# EasyEDA Pro project EasyEDA_Project_open PoE+ Pi HAT_2024-05-05.epro

# Schematic open PoE+ Pi HAT
Create Date: 2024-05-04; Page Name: SCH; Project Name: open PoE+ Pi HAT; Schematic Name: open PoE+ Pi HAT; Update Date: 2024-05-05; Company: Rex Tang; Page Size: A4; Version: V1.0
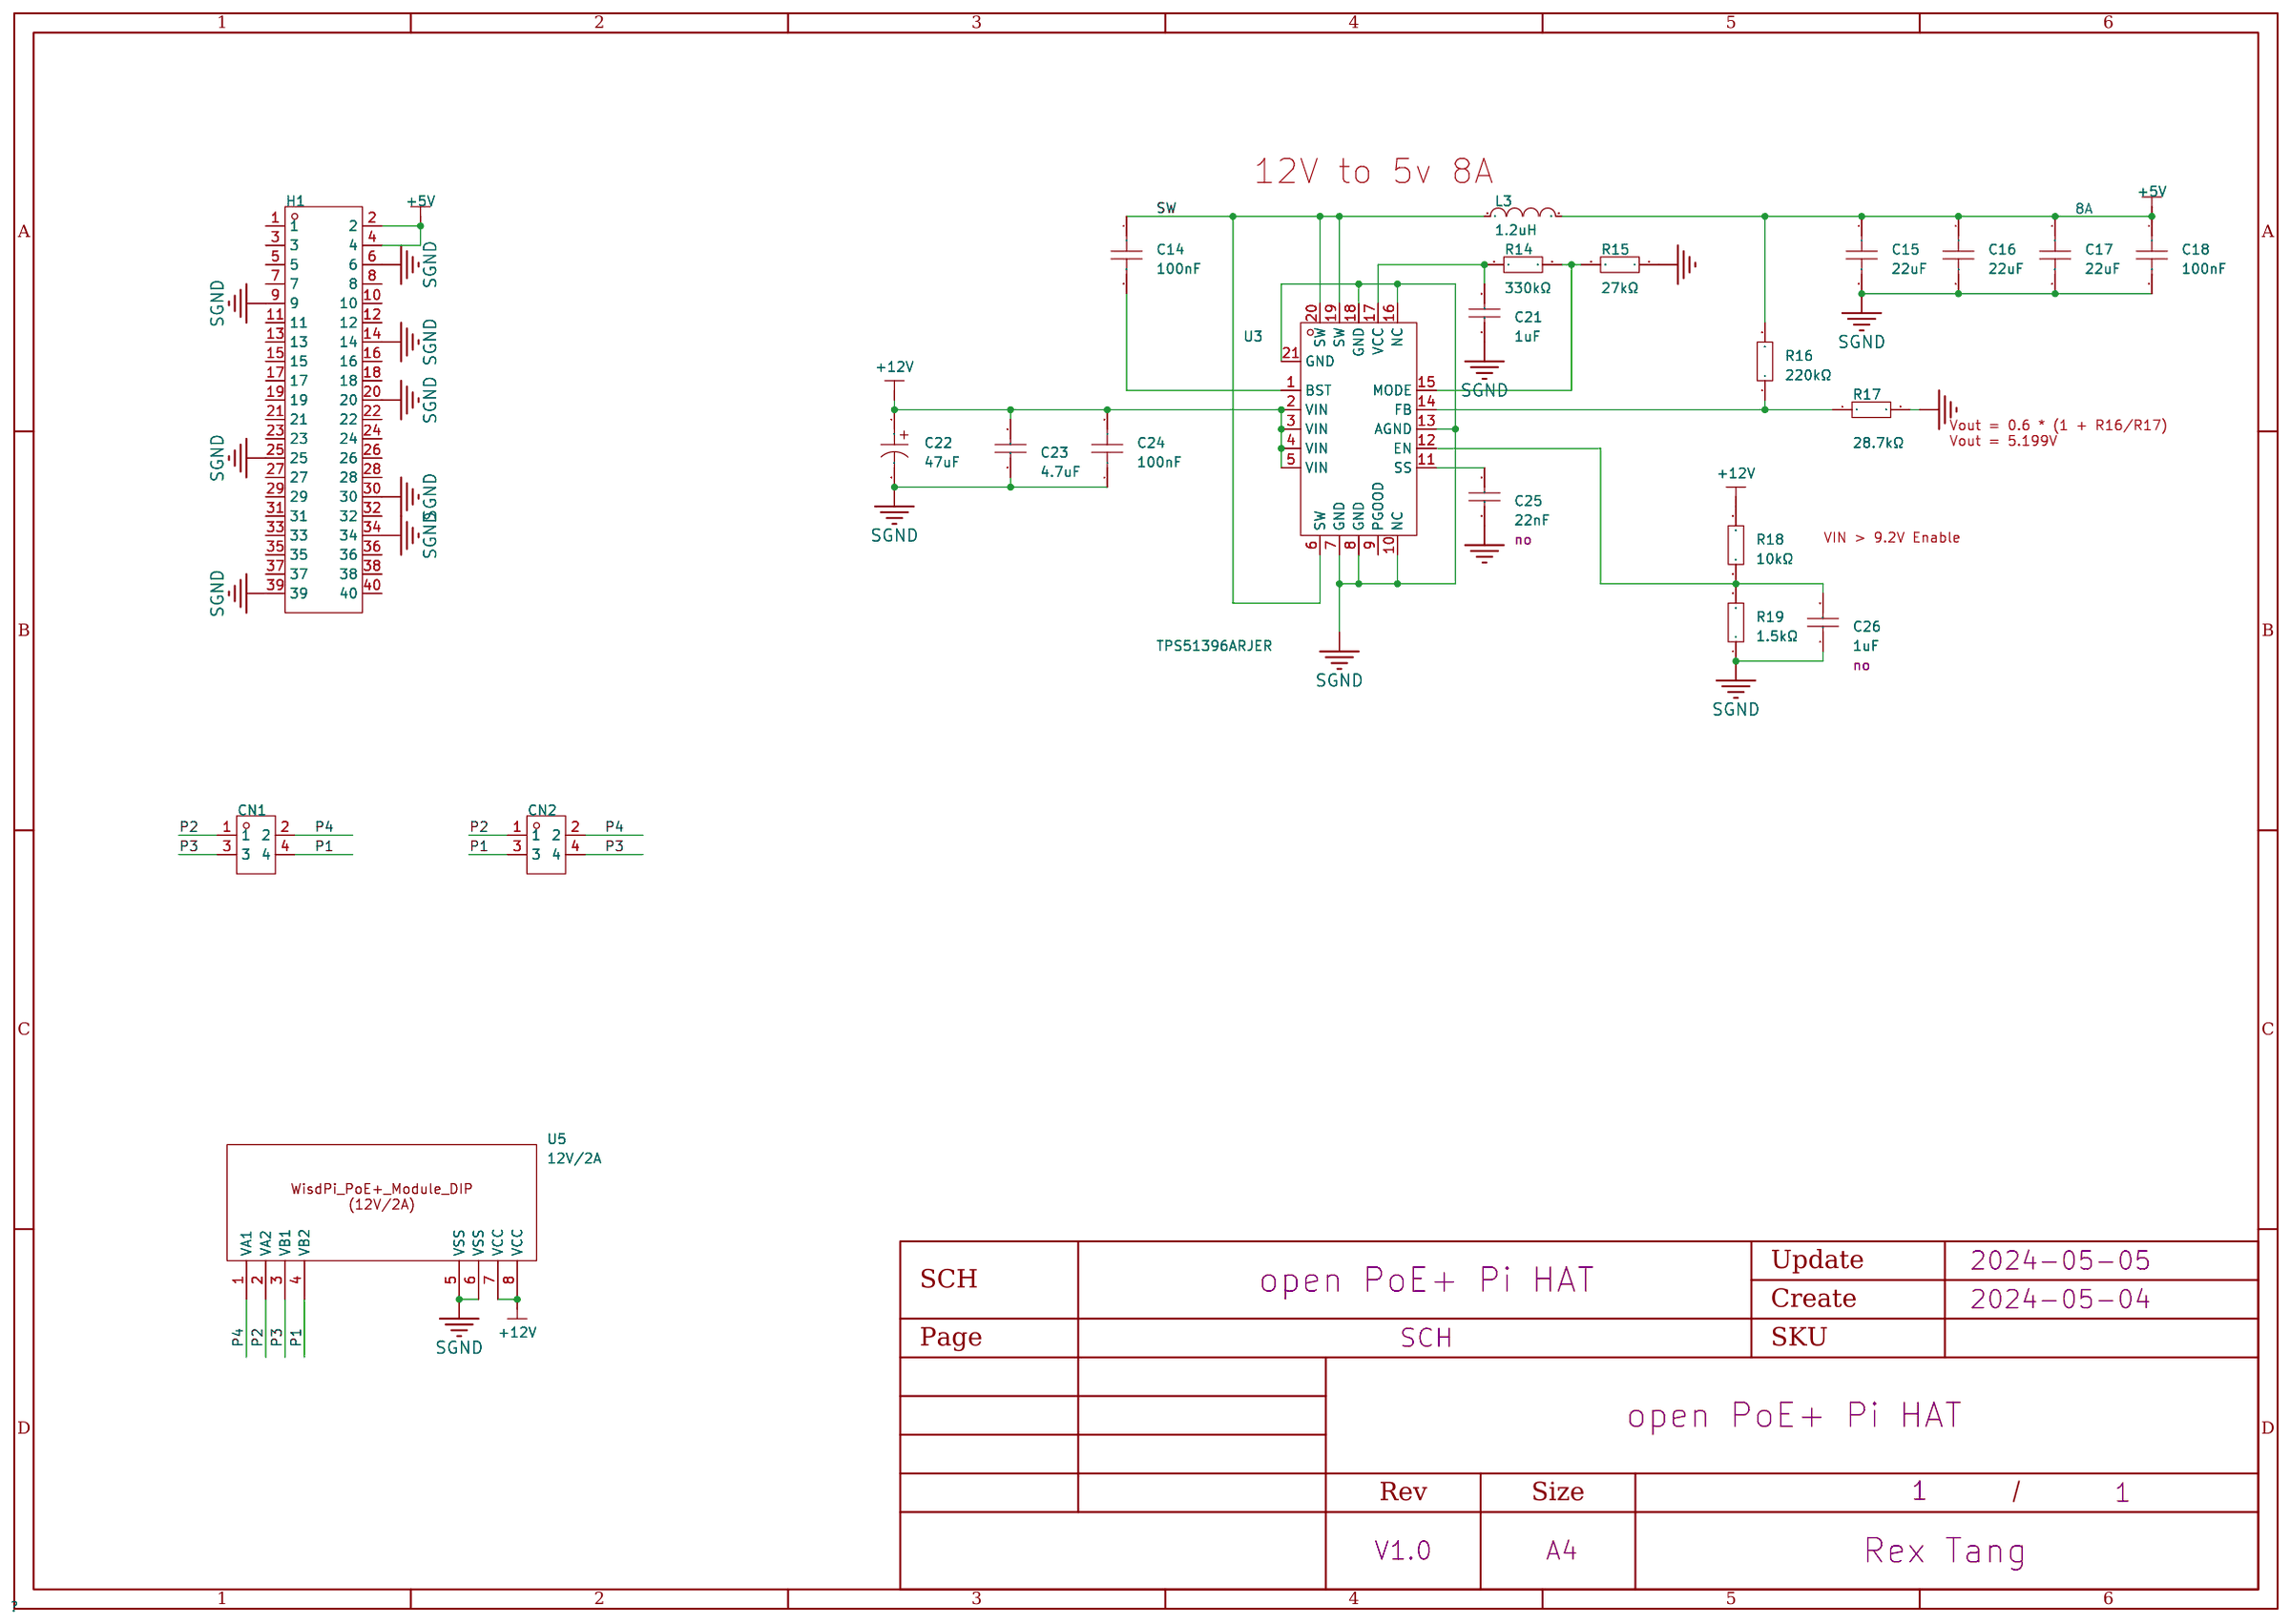
[diagram p0: schematic sheet]

## Parts
C14  100nF  [C0603]
C15  22uF  [C0603]
C16  22uF  [C0603]
C17  22uF  [C0603]
C18  100nF  [C0603]
C21  1uF  [C0603]
C22  47uF  [CAP-SMD_BD6.3-L6.6-W6.6-LS7.2-FD]
C23  4.7uF  [C1206]
C24  100nF  [C0603]
C25  22nF  [C0603]  (no BOM)
C26  1uF  [C0603]  (no BOM)
CN1  PM254-2-02-S-8.5  [HDR-SMD_4P-P2.54-V-F-R2-C2-S7.2]
CN2  PM254-2-02-S-8.5  [HDR-SMD_4P-P2.54-V-F-R2-C2-S7.2]
H1  FH-00339  [HDR-SMD_40P-P2.54-V-F-R2-C20-S6.6-EH]
L3  1.2uH  [IND-SMD_L5.4-W5.2]
R14  330kΩ  [R0603]
R15  27kΩ  [R0603]
R16  220kΩ  [R0603]
R17  28.7kΩ  [R0603]
R18  10kΩ  [R0603]
R19  1.5kΩ  [R0603]
U3  TPS51396ARJER  [QFN-20_L3.0-W3.0-P0.45-BL-EP1.0]
U5  12V/2A  [WisdPi_PoE+_Module_DIP]

## Library data of the parts
C14 C18 C24 = CL10B104KB8NNNC: 容值:100nF;精度:±10%;额定电压:50V;材质(温度系数):X7R;; LCSC Part Name: 100nF ±10% 50V; Supplier Part: C1591; Manufacturer: SAMSUNG(三星); Supplier Footprint: 0603; JLCPCB Part Class: Extended Part; Datasheet: https://atta.szlcsc.com/upload/public/pdf/source/20160103/1457707680512.pdf; Supplier: LCSC; Tolerance: ±10%; Voltage Rated: 50V; Temperature Coefficient: X7R
C15-C17 = CL10A226MP8NUNE: 容值:22uF;精度:±20%;额定电压:10V;材质(温度系数):X5R;; LCSC Part Name: 22uF ±20% 10V; Supplier Part: C86295; Manufacturer: SAMSUNG(三星); Supplier Footprint: 0603; JLCPCB Part Class: Extended Part; Datasheet: https://atta.szlcsc.com/upload/public/pdf/source/20170325/1490427882169.pdf; Supplier: LCSC; Tolerance: ±20%; Voltage Rated: 10V; Temperature Coefficient: X5R
C21 C26 = CL10A105KB8NNNC: 容值:1uF;精度:±10%;额定电压:50V;材质(温度系数):X5R;; LCSC Part Name: 1uF ±10% 50V; Supplier Part: C15849; Manufacturer: SAMSUNG(三星); Supplier Footprint: 0603; JLCPCB Part Class: Basic Part; Datasheet: https://atta.szlcsc.com/upload/public/pdf/source/20160103/1457707679084.pdf; Supplier: LCSC; Tolerance: ±10%; Voltage Rated: 50V; Temperature Coefficient: X5R
C22 = RVT47UF35V67RV0039: 容值:47uF;精度:±20%;额定电压:35V;纹波电流:16.4mA@120Hz;等效串联电阻:-;; LCSC Part Name: 47uF ±20% 35V; Supplier Part: C2836440; Manufacturer: KNSCHA(科尼盛); Supplier Footprint: SMD,D6.3xL5.4mm; JLCPCB Part Class: Extended Part; Datasheet: https://atta.szlcsc.com/upload/public/pdf/source/20210528/C2836440_FB61BB3A7A46B9CC2A608A35871DBF0C.pdf; Supplier: LCSC; Tolerance: ±20%; Rated Voltage: 35V; Ripple Current: 16.4mA@120Hz; φD: 6.3mm; L: 5.4mm; Lifetime @ Temp: 2000hrs@105℃; Operating Temperature: -55℃~+105℃
C23 = CL31B475KBHNNNE: 容值:4.7uF;精度:±10%;额定电压:50V;材质(温度系数):X7R;; LCSC Part Name: 4.7uF ±10% 50V; Supplier Part: C51205; Manufacturer: SAMSUNG(三星); Supplier Footprint: 1206; JLCPCB Part Class: Extended Part; Datasheet: https://atta.szlcsc.com/upload/public/pdf/source/20160103/1457707732693.pdf; Supplier: LCSC; Tolerance: ±10%; Voltage Rated: 50V; Temperature Coefficient: X7R
C25 = CL10B223KB8NNNC: 容值:22nF;精度:±10%;额定电压:50V;材质(温度系数):X7R;; LCSC Part Name: 22nF ±10% 50V; Supplier Part: C21122; Manufacturer: SAMSUNG(三星); Supplier Footprint: 0603; JLCPCB Part Class: Basic Part; Datasheet: https://atta.szlcsc.com/upload/public/pdf/source/20160103/1457707705232.pdf; Supplier: LCSC; Tolerance: ±10%; Voltage Rated: 50V; Temperature Coefficient: X7R
CN1 CN2 = PM254-2-02-S-8.5: 插孔结构:2x2P;间距:2.54mm;圆孔/方孔:方孔;安装类型:立贴;排数:双排;总孔位数:4P;额定电流:1A;插孔方向:顶部;塑高:8.5mm;; LCSC Part Name: 2x2P 间距:2.54mm 立贴; Supplier Part: C3975147; Manufacturer: HCTL(华灿天禄); Supplier Footprint: SMD,P=2.54mm; JLCPCB Part Class: 扩展库; Datasheet: https://atta.szlcsc.com/upload/public/pdf/source/20230609/7C6F8D8E301C6BBC8F19D55951C36597.pdf; Supplier: LCSC; Holes Structure: 2x2P; Pitch: 2.54mm; Circular Hole / Square Hole: 方孔; Mounting Type: 立贴; Number of Rows: 双排; Number of Holes: 4P; Current Rating (Max): 1A; Holes Direction: 顶部; Insulation Height: 8.5mm
H1 = FH-00339: 排数:双排;总孔位数:40P;间距:2.54mm;插孔结构:2x20P;行距:2.54mm;安装类型:立贴;圆孔/方孔:方孔;额定电流:3A;额定电压:-;插孔方向:顶部;塑高:3.9mm;工作温度范围:-40℃~+105℃;; LCSC Part Name: 间距:2.54mm 2x20P 立贴; Supplier Part: C2685112; Manufacturer: Liansheng(连盛); Supplier Footprint: SMD,P=2.54mm; JLCPCB Part Class: 扩展库; Datasheet: https://atta.szlcsc.com/upload/public/pdf/source/20210125/C2685112_060580B9A9680CD6D14F0E96D1B5C8CF.pdf; Supplier: LCSC; Number of Rows: 双排; Number of Holes: 40P; Pitch: 2.54mm; Holes Structure: 2x20P; Row Spacing: 2.54mm; Mounting Type: 立贴; Circular Hole / Square Hole: 方孔; Current Rating (Max): 3A; Holes Direction: 顶部; Insulation Height: 3.9mm; Operating Temperature Range: -40℃~+105℃
L3 = MWSA0503S-1R2MT: 精度:±20%;电感值:1.2uH;额定电流:-;直流电阻(DCR):-;; LCSC Part Name: 1.2uH ±20%; Supplier Part: C408356; Manufacturer: Sunlord(顺络); Supplier Footprint: SMD; JLCPCB Part Class: Extended Part; Datasheet: https://atta.szlcsc.com/upload/public/pdf/source/20190729/C408356_5A3E2289536D2ED1F8380EE8E4397875.pdf; Supplier: LCSC; Width: 5.4mm; Tolerance: ±20%; Height: 3mm; Length: 5.2mm
R14 = 0603WAF3303T5E: 电阻类型:厚膜电阻;阻值:330kΩ;精度:±1%;功率:100mW;; LCSC Part Name: 330kΩ ±1% 100mW; Supplier Part: C23137; Manufacturer: UNI-ROYAL(厚声); Supplier Footprint: 0603; JLCPCB Part Class: Basic Part; Datasheet: https://atta.szlcsc.com/upload/public/pdf/source/20200306/C422600_1E6D84923E4A46A82E41ADD87F860B5C.pdf; Supplier: LCSC; Type: 厚膜电阻; Tolerance: ±1%; Power(Watts): 100mW; Temperature Coefficient: ±100ppm/℃; Overload Voltage (Max): 75V; Operating Temperature Range: -55℃~+155℃
R15 = 0603WAF2702T5E: 电阻类型:厚膜电阻;阻值:27kΩ;精度:±1%;功率:100mW;; LCSC Part Name: 27kΩ ±1% 100mW; Supplier Part: C22967; Manufacturer: UNI-ROYAL(厚声); Supplier Footprint: 0603; JLCPCB Part Class: Basic Part; Datasheet: https://atta.szlcsc.com/upload/public/pdf/source/20200306/C422600_1E6D84923E4A46A82E41ADD87F860B5C.pdf; Supplier: LCSC; Type: 厚膜电阻; Tolerance: ±1%; Power(Watts): 100mW; Temperature Coefficient: ±100ppm/℃; Overload Voltage (Max): 75V; Operating Temperature Range: -55℃~+155℃
R16 = 0603WAF2203T5E: 电阻类型:厚膜电阻;阻值:220kΩ;精度:±1%;功率:100mW;; LCSC Part Name: 220kΩ ±1% 100mW; Supplier Part: C22961; Manufacturer: UNI-ROYAL(厚声); Supplier Footprint: 0603; JLCPCB Part Class: Basic Part; Datasheet: https://atta.szlcsc.com/upload/public/pdf/source/20200306/C422600_1E6D84923E4A46A82E41ADD87F860B5C.pdf; Supplier: LCSC; Type: 厚膜电阻; Tolerance: ±1%; Power(Watts): 100mW; Temperature Coefficient: ±100ppm/℃; Overload Voltage (Max): 75V; Operating Temperature Range: -55℃~+155℃
R17 = 0603WAF2872T5E: 阻值:28.7kΩ;精度:±1%;功率:100mW;温度系数:±100ppm/℃;电阻类型:厚膜电阻;; LCSC Part Name: 28.7kΩ ±1% 100mW 厚膜电阻; Supplier Part: C22928; Manufacturer: UNI-ROYAL(厚声); Supplier Footprint: 0603; JLCPCB Part Class: Extended Part; Datasheet: https://atta.szlcsc.com/upload/public/pdf/source/20200306/C422600_1E6D84923E4A46A82E41ADD87F860B5C.pdf; Supplier: LCSC; Tolerance: ±1%; Power(Watts): 100mW; Overload Voltage (Max): 75V; Temperature Coefficient: ±100ppm/℃; Type: 厚膜电阻; Operating Temperature Range: -55℃~+155℃
R18 = 0603WAF1002T5E: 电阻类型:厚膜电阻;阻值:10kΩ;精度:±1%;功率:100mW;; LCSC Part Name: 厚膜电阻 10kΩ ±1% 100mW; Supplier Part: C25804; Manufacturer: UNI-ROYAL(厚声); Supplier Footprint: 0603; JLCPCB Part Class: 基础库; Datasheet: https://atta.szlcsc.com/upload/public/pdf/source/20200306/C422600_1E6D84923E4A46A82E41ADD87F860B5C.pdf; Supplier: LCSC; Type: 厚膜电阻; Tolerance: ±1%; Power(Watts): 100mW; Temperature Coefficient: ±100ppm/℃; Overload Voltage (Max): 75V; Operating Temperature Range: -55℃~+155℃
R19 = 0603WAF1501T5E: 电阻类型:厚膜电阻;阻值:1.5kΩ;精度:±1%;功率:100mW;最大工作电压:75V;温度系数:±100ppm/℃;; LCSC Part Name: 1.5kΩ ±1% 100mW 厚膜电阻; Supplier Part: C22843; Manufacturer: UNI-ROYAL(厚声); Supplier Footprint: 0603; JLCPCB Part Class: 基础库; Datasheet: https://atta.szlcsc.com/upload/public/pdf/source/20200306/C422600_1E6D84923E4A46A82E41ADD87F860B5C.pdf; Supplier: LCSC; Type: 厚膜电阻; Tolerance: ±1%; Power(Watts): 100mW; Overload Voltage (Max): 75V; Temperature Coefficient: ±100ppm/℃; Operating Temperature Range: -55℃~+155℃
U3 = TPS51396ARJER: Supplier Part: C3032872; Manufacturer: TI(德州仪器); Supplier Footprint: QFN-20-EP(3x3); JLCPCB Part Class: Extended Part; Datasheet: https://atta.szlcsc.com/upload/public/pdf/source/20230222/57DF248B7417CFF68942295BEFB881A6.pdf; Supplier: LCSC
U5 = WisdPi_PoE+_Module_12V/2A_DIP: WisdPi_PoE+_Module_12V/2A PD-1202M; Manufacturer: WisdPi

## Nets
+5V: C15.1 C16.1 C17.1 C18.1 H1.2 H1.4 L3.2 R16.2
+12V: C22.1 C23.1 C24.2 R18.2 U3.2(VIN) U3.3(VIN) U3.4(VIN) U3.5(VIN) U5.7(VCC) U5.8(VCC)
SGND: C15.2 C16.2 C17.2 C18.2 C21.1 C22.2 C23.2 C24.1 C25.1 C26.1 H1.6 H1.9 H1.14 H1.20 H1.25 H1.30 H1.34 H1.39 R15.1 R17.2 R19.1 U3.7(GND) U3.8(GND) U3.10(NC) U3.13(AGND) U3.16(NC) U3.18(GND) U3.21(GND) U5.5(VSS) U5.6(VSS)
P1: CN1.4 CN2.3 U5.4(VB2)
P2: CN1.1 CN2.1 U5.2(VA2)
P3: CN1.3 CN2.4 U5.3(VB1)
P4: CN1.2 CN2.2 U5.1(VA1)
SW: C14.1 L3.1 U3.6(SW) U3.19(SW) U3.20(SW)
$1N37160: C14.2 U3.1(BST)
$1N37163: R14.2 R15.2 U3.15(MODE)
$1N37166: C21.2 R14.1 U3.17(VCC)
$1N37168: C25.2 U3.11(SS)
$1N37176: R16.1 R17.1 U3.14(FB)
$1N47522: C26.2 R18.1 R19.2 U3.12(EN)

Not connected (* = marked no-connect by the designer): H1 1 3 5 7 8 10 11 12 13 15 16 17 18 19 21 22 23 24 26 27 28 29 31 32 33 35 36 37 38 40; U3 9(PGOOD)

## Notes on the sheet
- 12V to 5v 8A
- 8A
- Vout = 0.6 * (1 + R16/R17)
  Vout = 5.199V
- VIN > 9.2V Enable

# Board open PoE+ Pi HAT
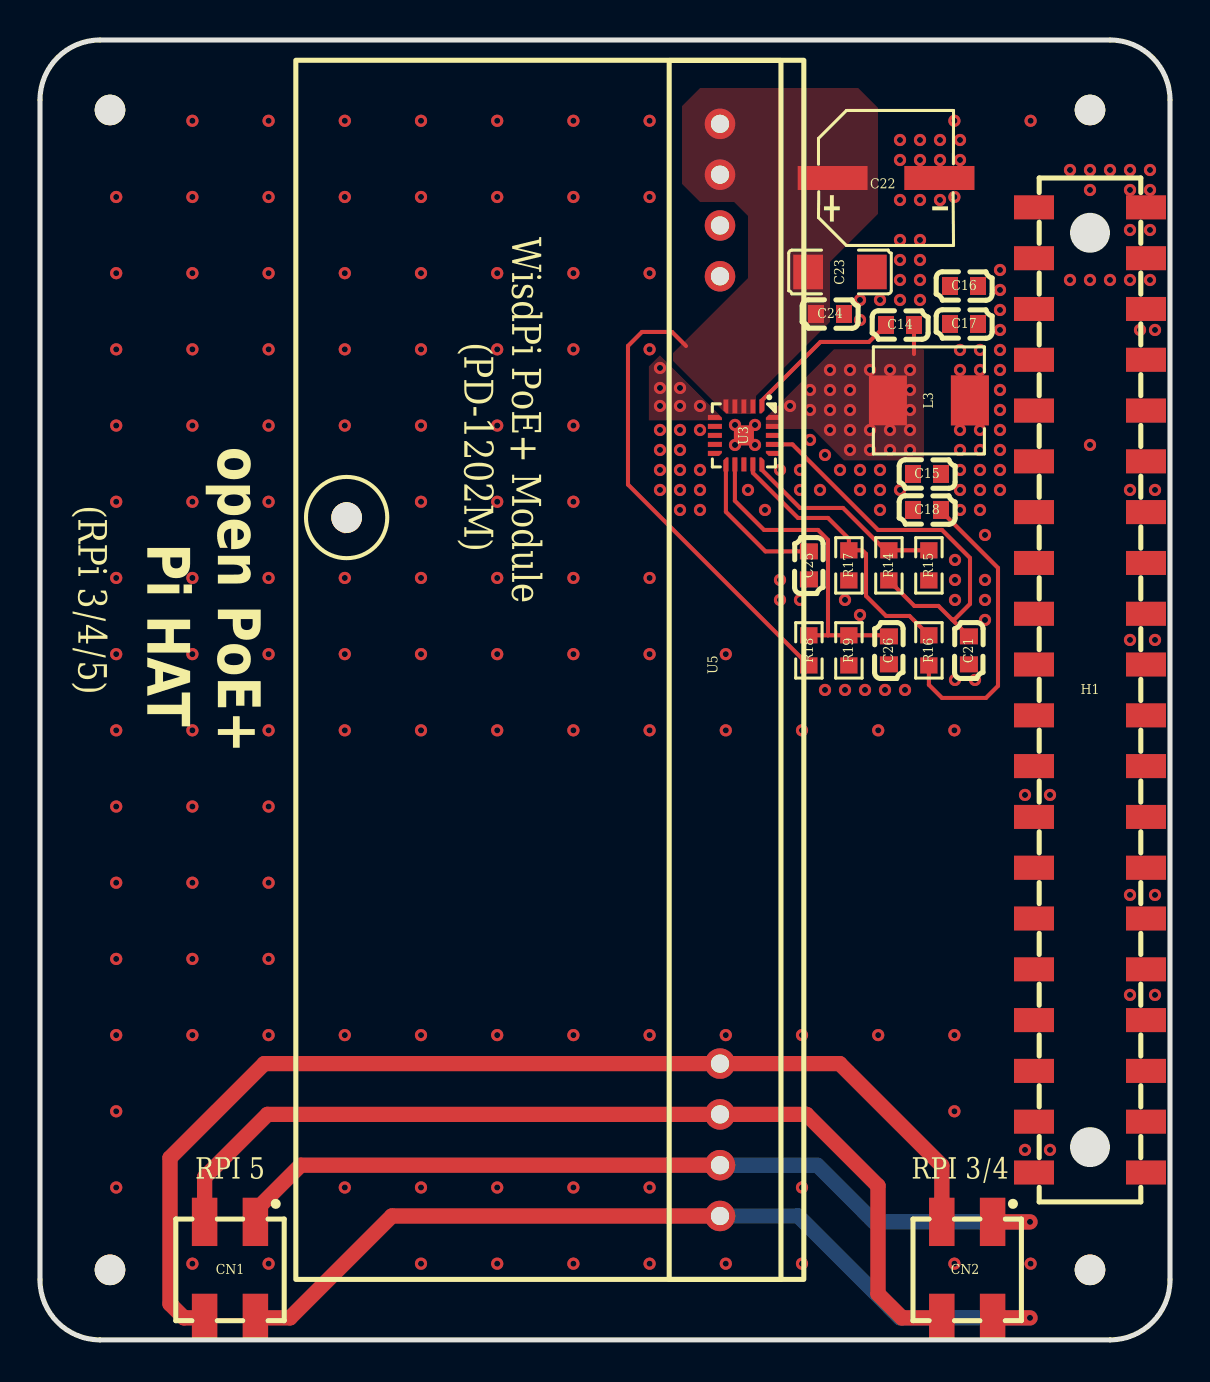
[diagram p1: board, top side]
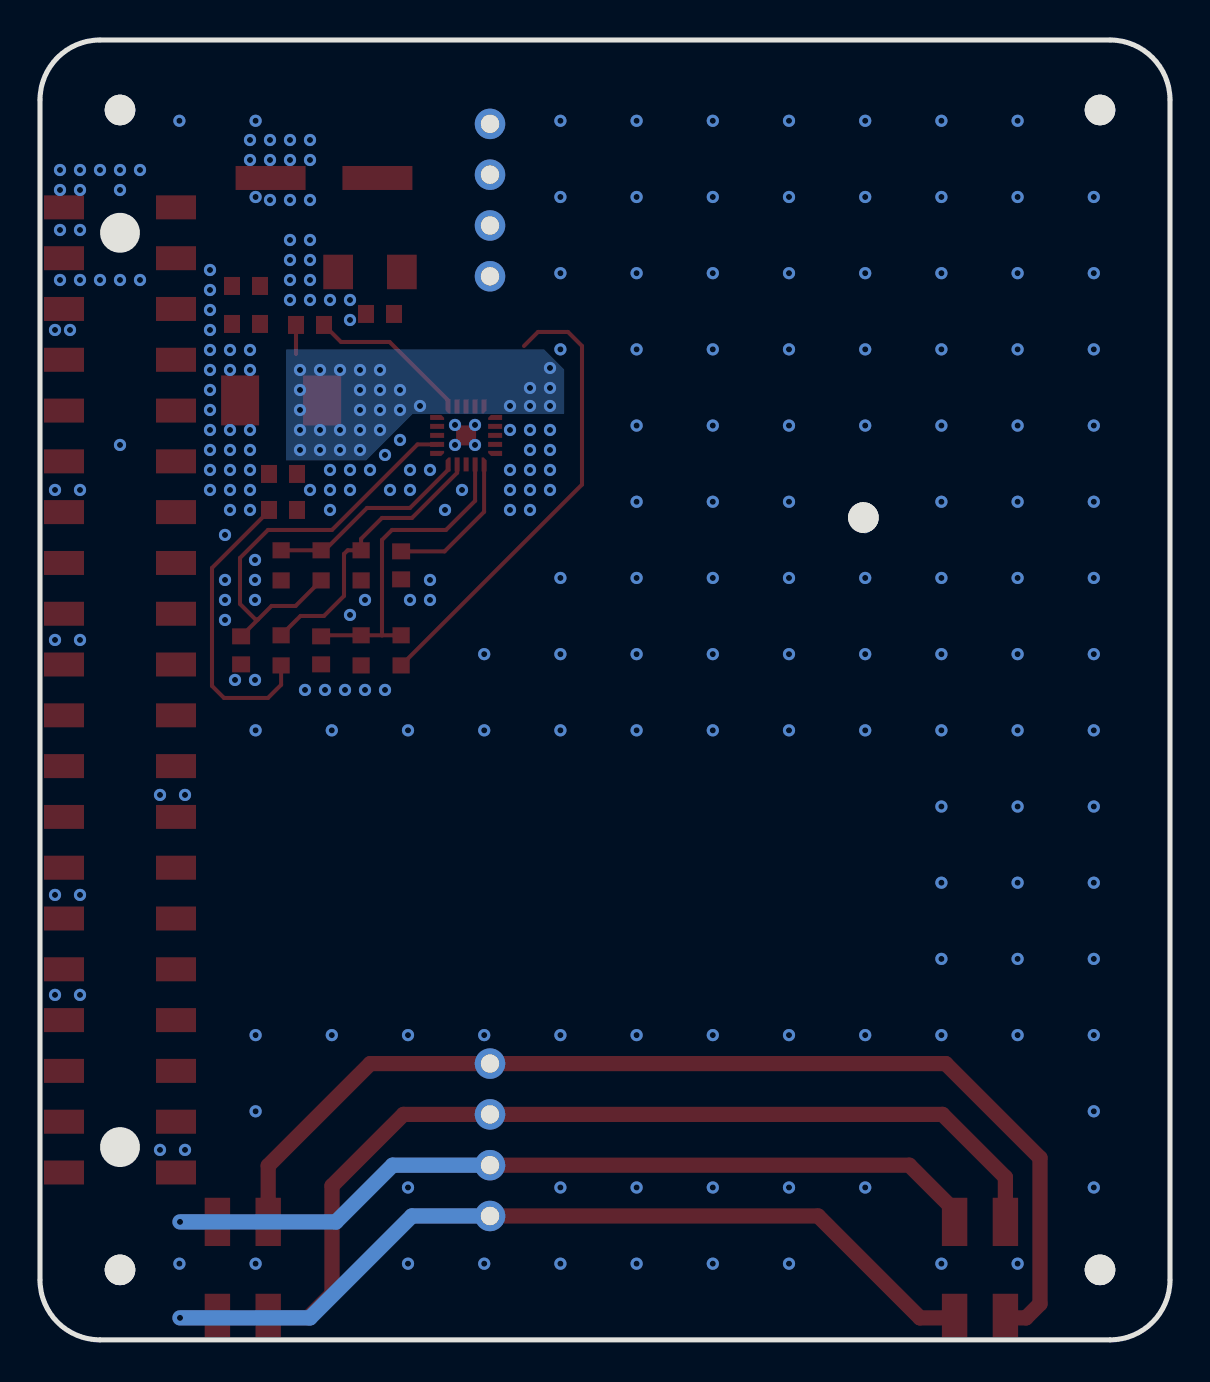
[diagram p2: board, bottom side, seen from below]

Outline 56.5 x 65 mm; copper layers: Top Layer, Bottom Layer. Coordinates in mm from the lower left corner of the outline.
Outline path: 0,62 0,3 arc(0.88,0.88) 3,0 53.5,0 arc(55.62,0.88) 56.5,3 56.5,62 arc(55.62,64.12) 53.5,65 3,65 arc(0.88,64.12) 0,62
Stack: Top Layer 0.035mm - / Dielectric1 1.51mm FR4 er 4.5 / Bottom Layer 0.035mm -

## Design rules (mm)
template: 自定义配置
spacing copperThickness1oz (default): track to track 0.102, other pairs 0 to 0.152
spacing copperThickness2oz: track to track 0.203, other pairs 0.152 to 0.3
spacing copperThicknessInner0.5oz: track to track 0.089, other pairs 0.152 to 0.3
track width copperThickness1oz (default): min 0.102, default 0.203, max 2.54
track width copperThickness2oz: min 0.203, default 0.254, max 2.54
track width copperThickness0.5oz: min 0.089, default 0.254, max 2.54
differential pair differentialPair (default): width min 0.127, default 0.254, max 2.54; gap min 0.152, default 0.152
via viaSize (default): diameter min 0.3, default 0.61, max 10; hole min 0.201, default 0.305, max 6.299

## Placement (name value [footprint] x y rotation side)
C14  100nF  [C0603]  43 50.75 180 top
C15  22uF  [C0603]  44.35 43.3 180 top
C16  22uF  [C0603]  46.2 52.7 180 top
C17  22uF  [C0603]  46.2 50.8 180 top
C18  100nF  [C0603]  44.35 41.5 180 top
C21  1uF  [C0603]  46.44 34.48 90 top
C22  47uF  [CAP-SMD_BD6.3-L6.6-W6.6-LS7.2-FD]  42.3 58.1 0 top
C23  4.7uF  [C1206]  40 53.4 0 top
C24  100nF  [C0603]  39.5 51.3 180 top
C25  22nF  [C0603]  38.44 38.73 90 top
C26  1uF  [C0603]  42.44 34.48 90 top
CN1  PM254-2-02-S-8.5  [hdr-smd_4p-p2.54-v-f-r2-c2-s7.2]  9.5 3.5 180 top
CN2  PM254-2-02-S-8.5  [hdr-smd_4p-p2.54-v-f-r2-c2-s7.2]  46.36 3.5 180 top
H1  FH-00339  [hdr-smd_40p-p2.54-v-f-r2-c20-s6.6-eh]  52.5 32.5 270 top
L3  1.2uH  [IND-SMD_L5.4-W5.2]  44.44 46.98 180 top
NOREF  -  [Pad_e372]  52.5 61.5 90 top
NOREF#2  -  [Pad_e373]  3.5 3.5 90 top
NOREF#3  -  [Pad_e371]  3.5 61.5 90 top
NOREF#4  -  [Pad_e673]  15.33 41.12 90 top
NOREF#5  -  [Pad_e374]  52.5 3.5 90 top
R14  330kΩ  [R0603]  42.44 38.73 90 top
R15  27kΩ  [R0603]  44.44 38.73 90 top
R16  220kΩ  [R0603]  44.44 34.48 270 top
R17  28.7kΩ  [R0603]  40.44 38.73 270 top
R18  10kΩ  [R0603]  38.44 34.48 270 top
R19  1.5kΩ  [R0603]  40.44 34.48 90 top
U3  TPS51396ARJER  [QFN-20_L3.0-W3.0-P0.45-BL-EP1.0]  35.19 45.23 180 top
U5  12V/2A  [WisdPi_PoE+_Module_DIP]  34 33.5 90 top

## Footprints (pads in the part's own frame, mm; a bottom-side part is the same pattern mirrored in y, then rotated)
C0603
  rect 0.8x0.9 smd: 1(-0.7,0) 2(0.7,0)
C1206
  rect 1.485x1.728 smd: 1(-1.593,0) 2(1.593,0)
CAP-SMD_BD6.3-L6.6-W6.6-LS7.2-FD
  rect 3.5x1.2 smd: 1(-2.67,0) 2(2.67,0)
hdr-smd_4p-p2.54-v-f-r2-c2-s7.2
  rect 1.27x2.413 smd: 1(-1.27,-2.4) 2(-1.27,2.4) 3(1.27,-2.4) 4(1.27,2.4)
hdr-smd_40p-p2.54-v-f-r2-c20-s6.6-eh
  rect 1.2x2 smd: 1(-24.13,-2.8) 2(-24.13,2.8) 3(-21.59,-2.8) 4(-21.59,2.8) 5(-19.05,-2.8) 6(-19.05,2.8) 7(-16.51,-2.8) 8(-16.51,2.8) 9(-13.97,-2.8) 10(-13.97,2.8) 11(-11.43,-2.8) 12(-11.43,2.8) 13(-8.89,-2.8) 14(-8.89,2.8) 15(-6.35,-2.8) 16(-6.35,2.8) 17(-3.81,-2.8) 18(-3.81,2.8) 19(-1.27,-2.8) 20(-1.27,2.8) 21(1.27,-2.8) 22(1.27,2.8) 23(3.81,-2.8) 24(3.81,2.8) 25(6.35,-2.8) 26(6.35,2.8) 27(8.89,-2.8) 28(8.89,2.8) 29(11.43,-2.8) 30(11.43,2.8) 31(13.97,-2.8) 32(13.97,2.8) 33(16.51,-2.8) 34(16.51,2.8) 35(19.05,-2.8) 36(19.05,2.8) 37(21.59,-2.8) 38(21.59,2.8) 39(24.13,-2.8) 40(24.13,2.8)
IND-SMD_L5.4-W5.2
  rect 1.9x2.5 smd: 1(2.05,0) 2(-2.05,0)
Pad_e371
  round 1.524 hole 2.5: 0(0,0)
Pad_e372
  round 1.524 hole 2.5: 0(0,0)
Pad_e373
  round 1.524 hole 2.5: 0(0,0)
Pad_e374
  round 1.524 hole 2.5: 0(0,0)
Pad_e673
  round 1.524 hole 2.5: 0(0,0)
QFN-20_L3.0-W3.0-P0.45-BL-EP1.0
  custom 0.253x0.7 smd: 1(-0.9,-1.459)
  rect 0.252x0.7 smd: 2(-0.45,-1.45) 3(0,-1.45) 4(0.45,-1.45) 12(0.45,1.45) 13(0,1.45) 14(-0.45,1.45)
  custom 0.252x0.701 smd: 5(0.9,-1.46) 11(0.899,1.46)
  custom 0.7x0.252 smd: 6(1.45,-0.9) 10(1.45,0.899) 20(-1.45,-0.9)
  rect 0.7x0.252 smd: 7(1.45,-0.45) 8(1.45,0) 9(1.45,0.45) 17(-1.45,0.45) 18(-1.45,0) 19(-1.45,-0.45)
  custom 0.253x0.701 smd: 15(-0.9,1.46)
  custom 0.7x0.253 smd: 16(-1.449,0.9)
  rect 1x1 smd: 21(0,0)
R0603
  rect 0.806x0.864 smd: 1(-0.753,0) 2(0.753,0)
WisdPi_PoE+_Module_DIP
  round 1.524 hole 0.914: 1(-27.305,0) 2(-24.765,0) 3(-22.225,0) 4(-19.685,0) 5(19.685,0) 6(22.225,0) 7(24.765,0) 8(27.305,0)

## Nets
As in the schematic.

Pads without a net: H1 1 3 5 7 8 10 11 12 13 15 16 17 18 19 21 22 23 24 26 27 28 29 31 32 33 35 36 37 38 40; NOREF 0; NOREF#2 0; NOREF#3 0; NOREF#4 0; NOREF#5 0; U3 9

## Via types
v1: diameter 0.61, hole 0.304, Top Layer to Bottom Layer, 1 via
v2: diameter 0.61, hole 0.305, Top Layer to Bottom Layer, 276 vias

## Routing (per net, layer and track width the routed paths; a pad name or vN(x,y) marks a point on that pad's centre or on a via; arc(x,y) is an arc through that point)
+5V: length 14.9
  Top Layer w0.203: R16.2 44.44,32.76 45.1,32.1 47.3,32.1 47.9,32.7 47.9,38.6 45.05,41.45 C18.1
  vias: v2(46,49.5) v2(46,48.5) v2(46,45.5) v2(46,44.5) v2(46,43.5) v2(46,42.5) v2(46,41.5) v2(47,49.5) v2(47,48.5) v2(47,45.5) v2(47,44.5) v2(47,43.5) v2(47,42.5) v2(47,41.5) v2(48,53.5) v2(48,52.5) v2(48,51.5) v2(48,50.5) v2(48,49.5) v2(48,48.5) v2(48,47.5) v2(48,46.5) v2(48,45.5) v2(48,44.5) v2(48,43.5) v2(48,42.5) v2(51.5,58.5) v2(51.5,53) v2(52.5,58.5) v2(52.5,57.5) v2(52.5,53) v2(53.5,58.5) v2(53.5,53) v2(54.5,58.5) v2(54.5,57.5) v2(54.5,55.5) v2(54.5,53) v2(55.5,58.5) v2(55.5,57.5) v2(55.5,55.5) v2(55.5,53)
+12V: length 23.2
  Top Layer w0.203: R18.2 29.4,42.77 29.4,49.7 30.1,50.4 31.6,50.4 32.3,49.7
SGND:
  vias: v2(3.81,57.15) v2(3.81,53.34) v2(3.81,49.53) v2(3.81,45.72) v2(3.81,41.91) v2(3.81,38.1) v2(3.81,34.29) v2(3.81,30.48) v2(3.81,26.67) v2(3.81,22.86) v2(3.81,19.05) v2(3.81,15.24) v2(3.81,11.43) v2(3.81,7.62) v2(7.62,60.96) v2(7.62,57.15) v2(7.62,53.34) v2(7.62,49.53) v2(7.62,45.72) v2(7.62,41.91) v2(7.62,38.1) v2(7.62,34.29) v2(7.62,30.48) v2(7.62,26.67) v2(7.62,22.86) v2(7.62,19.05) v2(7.62,15.24) v2(7.62,3.81) v2(11.43,60.96) v2(11.43,57.15) v2(11.43,53.34) v2(11.43,49.53) v2(11.43,45.72) v2(11.43,41.91) v2(11.43,38.1) v2(11.43,34.29) v2(11.43,30.48) v2(11.43,26.67) v2(11.43,22.86) v2(11.43,19.05) v2(11.43,15.24) v2(11.43,3.81) v2(15.24,60.96) v2(15.24,57.15) v2(15.24,53.34) v2(15.24,49.53) v2(15.24,45.72) v2(15.24,38.1) v2(15.24,34.29) v2(15.24,30.48) v2(15.24,15.24) v2(15.24,7.62) v2(19.05,60.96) v2(19.05,57.15) v2(19.05,53.34) v2(19.05,49.53) v2(19.05,45.72) v2(19.05,41.91) v2(19.05,38.1) v2(19.05,34.29) v2(19.05,30.48) v2(19.05,15.24) v2(19.05,7.62) v2(19.05,3.81) v2(22.86,60.96) v2(22.86,57.15) v2(22.86,53.34) v2(22.86,49.53) v2(22.86,45.72) v2(22.86,41.91) v2(22.86,38.1) v2(22.86,34.29) v2(22.86,30.48) v2(22.86,15.24) v2(22.86,7.62) v2(22.86,3.81) v2(26.67,60.96) v2(26.67,57.15) v2(26.67,53.34) v2(26.67,49.53) v2(26.67,45.72) v2(26.67,41.91) v2(26.67,38.1) v2(26.67,34.29) v2(26.67,30.48) v2(26.67,15.24) v2(26.67,7.62) v2(26.67,3.81) v2(30.48,60.96) v2(30.48,57.15) v2(30.48,53.34) v2(30.48,49.53) v2(30.48,38.1) v2(30.48,34.29) v2(30.48,30.48) v2(30.48,15.24) v2(30.48,7.62) v2(30.48,3.81) v2(31,45.5) v2(31,44.5) v2(31,43.5) v2(31,42.5) v2(32,45.5) v2(32,44.5) v2(32,43.5) v2(32,42.5) v2(32,41.5) v2(33,45.5) v2(33,43.5) v2(33,42.5) v2(33,41.5) v2(34.29,34.29) v2(34.29,30.48) v2(34.29,15.24) v2(34.29,3.81) v2(34.75,45.75) v2(34.75,44.75) v2(35.4,42.5) v2(35.75,45.75) v2(35.75,44.75) v2(36.25,41.5) v2(37,43.5) v2(37,38) v2(37,37) v2(38,43.5) v2(38,42.5) v2(38,37) v2(38.1,30.48) v2(38.1,15.24) v2(38.1,7.62) v2(38.1,3.81) v2(38.5,45) v2(39,42.5) v2(39.25,44.25) v2(39.25,32.5) v2(40,43.5) v2(40.25,37) v2(40.25,32.5) v2(41,52) v2(41,51) v2(41,43.5) v2(41,42.5) v2(41,36.25) v2(41.25,32.5) v2(41.91,30.48) v2(41.91,15.24) v2(42,52) v2(42,43.5) v2(42,42.5) v2(42,41.5) v2(42.25,32.5) v2(43,60) v2(43,59) v2(43,57) v2(43,55) v2(43,54) v2(43,53) v2(43,52) v2(43,42.5) v2(43.25,32.5) v2(44,60) v2(44,59) v2(44,57) v2(44,55) v2(44,54) v2(44,53) v2(44,52) v2(45,60) v2(45,59) v2(45,57) v2(45.72,60.96) v2(45.72,57.15) v2(45.72,30.48) v2(45.72,15.24) v2(45.72,11.43) v2(45.72,3.81) v2(45.75,39) v2(45.75,38) v2(45.75,37) v2(45.75,33) v2(46,60) v2(46,59) v2(46.75,33) v2(47.25,40.25) v2(47.25,38) v2(47.25,37) v2(47.25,36) v2(49.25,27.25) v2(49.25,9.5) v2(49.53,60.96) v2(49.53,3.81) v2(50.5,27.25) v2(50.5,9.5) v2(52.5,44.75) v2(54.5,42.5) v2(54.5,35) v2(54.5,22.25) v2(54.5,17.25) v2(55,50.5) v2(55.75,50.5) v2(55.75,42.5) v2(55.75,35) v2(55.75,22.25) v2(55.75,17.25)
(no net):
  vias: v1(15.24,40.64)
P1: length 54.8
  Top Layer w0.762: CN1.4 7.2,1.1 6.5,1.8 6.5,9.1 11.22,13.81 U5.4 39.99,13.81 45.09,8.71 CN2.3
P2: length 43.3
  Top Layer w0.762: CN1.1 10.77,6.47 13.03,8.73 U5.2 ; CN2.1 v2(49.5,5.9)
  Bottom Layer w0.762: v2(49.5,5.9) 41.7,5.9 38.87,8.73 U5.2
P3: length 47.8
  Top Layer w0.762: CN2.4 43.1,1.1 41.9,2.3 41.9,7.7 38.32,11.28 U5.3 11.38,11.28 8.23,8.13 CN1.3
P4: length 44.8
  Top Layer w0.762: CN1.2 12.5,1.1 17.59,6.19 U5.1 ; CN2.2 v2(49.5,1.1)
  Bottom Layer w0.762: v2(49.5,1.1) 43,1.1 37.91,6.19 U5.1
SW: length 1.5
  Top Layer w0.203: C14.1 43.7,49.3
  vias: v2(31,48.6) v2(31,47.6) v2(31,46.7) v2(32,47.6) v2(32,46.7) v2(33,46.7) v2(37.5,46.7) v2(38.5,47.5) v2(38.5,46.5) v2(39.5,48.5) v2(39.5,47.5) v2(39.5,46.5) v2(39.5,45.5) v2(40.5,48.5) v2(40.5,47.5) v2(40.5,46.5) v2(40.5,45.5) v2(40.5,44.5) v2(41.5,48.5) v2(41.5,45.5) v2(41.5,44.5) v2(42.5,48.5) v2(42.5,45.5) v2(42.5,44.5) v2(43.5,48.5) v2(43.5,47.5) v2(43.5,46.5) v2(43.5,45.5) v2(43.5,44.5)
$1N37160: length 8.1
  Top Layer w0.203: 36.09,46.69 36.09,46.97 39.02,49.9 41.45,49.9 C14.2
$1N37163: length 10.3
  Top Layer w0.203: 44.44,39.48 42.27,39.48 40.15,41.6 38,41.6 36.09,43.51 36.09,43.77
$1N37166: length 20.9
  Top Layer w0.203: 45.59,36.03 44.92,36.7 43.72,36.7 R14.1 ; 45.59,36.03 45.73,36.03 46.5,36.8 46.5,39.1 45.1,40.5 41.9,40.5 37.62,44.78 U3.17 ; 45.59,36.03 C21.2
$1N37168: length 7.3
  Top Layer w0.203: C25.2 36.27,39.43 34.29,41.41 U3.11
$1N37176: length 14.2
  Top Layer w0.203: R16.1 43.48,36.2 42.3,36.2 41.3,37.2 41.3,39.3 41.12,39.48 40.44,39.48 40.44,40.06 39.4,41.1 37.9,41.1 35.64,43.36 U3.14
$1N47522: length 16.1
  Top Layer w0.203: 39.4,35.23 R19.2 42.39,35.23 C26.2 ; 39.4,35.23 R18.1 ; 39.4,35.23 39.4,40 38.9,40.5 36.2,40.5 34.74,41.96 U3.12

## Copper pours and planes (outline as drawn; the poured copper is in the pictures)
+5V on Top Layer: 44.5,41 47.75,41 48.75,42 48.75,52.5 56,52.5 56.25,52.75 56.25,58.75 56,59 48.75,59 46.25,56.5 46.25,50.25 44.5,48.5
+5V on Bottom Layer: 44.5,41 47.75,41 53.75,47 53.75,50.25 56.25,52.75 56.25,58.75 56,59 48.75,59 46.25,56.5 46.25,50.25 44.5,48.5
+12V on Top Layer: 31.65,62.6 41.9,62.6 41.9,46.3 31.65,46.3
SGND on Top Layer: 0,65 56.5,65 56.5,0 0,0
SGND on Bottom Layer: 0,65 56.5,65 56.5,0 0,0
SW on Top Layer: 36.29,49.53 44.19,49.53 44.19,43.98 36.29,43.98
SW on Top Layer: 30.44,49.23 34.09,49.23 34.09,45.98 30.44,45.98
SW on Bottom Layer: 30.29,49.53 44.19,49.53 44.19,43.98 30.29,43.98

## Text on the board
Top Silkscreen Layer: open PoE+ / Pi HAT | RPI 5 | RPI 3/4 | (RPi 3/4/5) | WisdPi PoE+ Module / (PD-1202M)
